# Altium schematic sheet USB-C_to_ESP.SchDoc
size B; SheetNumber: 2; SheetTotal: 6
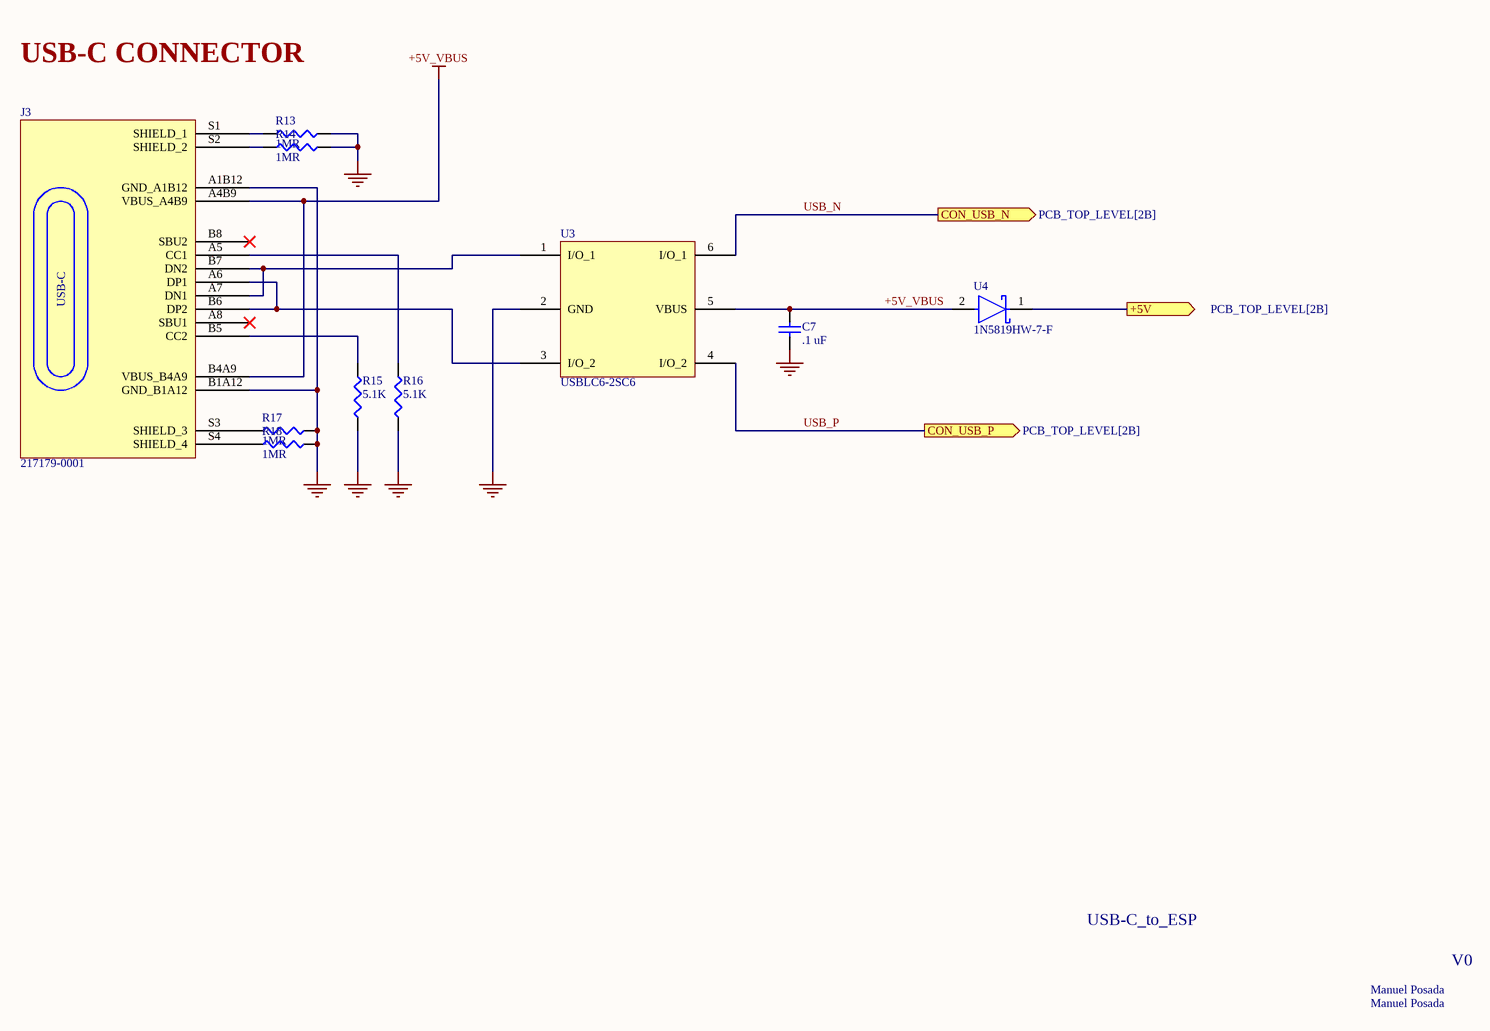
[diagram p0: USB-C_to_ESP.SchDoc]

## Parts
C7  .1 uF  [CAP_CL21_SAM-L]
J3  217179-0001  [FP-2171790001-MFG]
R13  1MR  [RES_1220_SUS-L]
R14  1MR  [RES_1220_SUS-L]
R15  5.1K  [RES_1220_SUS-L]
R16  5.1K  [RES_1220_SUS-L]
R17  1MR  [RES_1220_SUS-L]
R18  1MR  [RES_1220_SUS-L]
U3  USBLC6-2SC6  [SOT23-6L_STM]
U4  1N5819HW-7-F  [FP-SOD123-IPC_B]

## Ports
+5V (out, see PCB_TOP_LEVEL[2B]), CON_USB_N (out, see PCB_TOP_LEVEL[2B]), CON_USB_P (out, see PCB_TOP_LEVEL[2B])

## Nets
+5V_VBUS: C7.2 J3.A4B9(VBUS_A4B9) J3.B4A9(VBUS_B4A9) U3.5(VBUS) U4.2(A)
GND: C7.1 J3.A1B12(GND_A1B12) J3.B1A12(GND_B1A12) R13.2 R14.2 R15.1 R16.1 R17.2 R18.2 U3.2(GND)
+5V: U4.1(C) ; port +5V
USB_N: U3.6(I/O_1) ; port CON_USB_N
USB_P: U3.4(I/O_2) ; port CON_USB_P
NetJ3_A5: J3.A5(CC1) R16.2
NetJ3_A6: J3.A6(DP1) J3.B6(DP2) U3.3(I/O_2)
NetJ3_A7: J3.A7(DN1) J3.B7(DN2) U3.1(I/O_1)
NetJ3_B5: J3.B5(CC2) R15.2
NetJ3_S1: J3.S1(SHIELD_1) R13.1
NetJ3_S2: J3.S2(SHIELD_2) R14.1
NetJ3_S3: J3.S3(SHIELD_3) R17.1
NetJ3_S4: J3.S4(SHIELD_4) R18.1

Not connected (* = marked no-connect by the designer): J3 A8(SBU1)* B8(SBU2)*

## Notes on the sheet
- USB-C CONNECTOR
- USB-C_to_ESP
- Manuel Posada
- V0
- (in symbol 217179-0001) USB-C

## Library data of the parts
C7 = CL21B104KBCNNNC: 50V 100nF X7R ±10% 0805 Multilayer Ceramic Capacitors MLCC - SMD/SMT ROHS; Manufacturer: Samsung Electro-Mechanics; Supplier: DigiKey; Supplier Part Number: 1276-1003-6-ND; Manufacturer Part Number: CL21B104KBCNNNC; RoHS: Compliant; Category: Ceramic Capacitors; Stock: 2859375; Pricing: 1=0.08, 10=0.006 (USD); Value: 100nF; Case/Package: 0805; Case Code (Imperial): 0805; Case Code (Metric): 2012; China RoHS: Compliant; Contact Plating: Tin; Country of Origin: Mainland China, Philippines, South Korea; Depth: 1.25mm; Dielectric: X7R; Dielectric Material: Ceramic; Export Control Classification Number (ECCN) Code: EAR99; Height: 950µm; Harmonized Tariff Schedule (HTS) Code: 8532.24.00.20; Introduction Date: 2009-07-27; Lead Free: Lead Free; Length: 2mm; Lifecycle Status: Production; Material: Ceramic; Max Operating Temperature: 125°C; Min Operating Temperature: -55°C; Mounting Technology: Surface Mount; Number of Terminals: 2; Radiation Hardening: No; REACH SVHC: Yes; Schedule B: 8532240020, 8532240020|8532240020, 8532240020|8532240020|8532240020, 8532240020|8532240020|8532240020|8532240020; Thickness: 939.8µm; Tolerance: 10%; Voltage: 50V; Voltage Rating: 50V; Voltage Rating (DC): 50V; Width: 1.25mm; ComponentLink1URL: https://datasheet.octopart.com:443/CL21B104KBCNNNC-Samsung-Electro-Mechanics-datasheet-137745078.pdf?src-supplier=IHS; ComponentLink1Description: https://datasheet.octopart.com:443/CL21B104KBCNNNC-Samsung-Electro-Mechanics-datasheet-137745078.pdf?src-supplier=IHS; ComponentLink2URL: https://datasheet.octopart.com/CL21B104KBCNNNC-Samsung-Electro-Mechanics-datasheet-8324245.pdf; ComponentLink2Description: https://datasheet.octopart.com/CL21B104KBCNNNC-Samsung-Electro-Mechanics-datasheet-8324245.pdf; ComponentLink3URL: https://datasheet.octopart.com/CL21B104KBCNNNC-Samsung-Electro-Mechanics-datasheet-97040617.pdf; ComponentLink3Description: https://datasheet.octopart.com/CL21B104KBCNNNC-Samsung-Electro-Mechanics-datasheet-97040617.pdf; ComponentLink4URL: https://datasheet.octopart.com:443/CL21B104KBCNNNC-Samsung-Electro-Mechanics-datasheet-11548950.pdf?src-supplier=Future+Electronics; ComponentLink4Description: https://datasheet.octopart.com:443/CL21B104KBCNNNC-Samsung-Electro-Mechanics-datasheet-11548950.pdf?src-supplier=Future+Electronics; ComponentLink5URL: https://datasheet.octopart.com:443/CL21B104KBCNNNC-Samsung-Electro-Mechanics-datasheet-116891032.pdf?src-supplier=Future+Electronics; ComponentLink5Description: https://datasheet.octopart.com:443/CL21B104KBCNNNC-Samsung-Electro-Mechanics-datasheet-116891032.pdf?src-supplier=Future+Electronics; ComponentLink6URL: https://datasheet.octopart.com:443/CL21B104KBCNNNC-Samsung-Electro-Mechanics-datasheet-81462175.pdf?src-supplier=Future+Electronics; ComponentLink6Description: https://datasheet.octopart.com:443/CL21B104KBCNNNC-Samsung-Electro-Mechanics-datasheet-81462175.pdf?src-supplier=Future+Electronics; ComponentLink7URL: https://datasheet.octopart.com:443/CL21B104KBCNNNC-Samsung-datasheet-42485244.pdf?src-supplier=Future+Electronics; ComponentLink7Description: https://datasheet.octopart.com:443/CL21B104KBCNNNC-Samsung-datasheet-42485244.pdf?src-supplier=Future+Electronics; ComponentLink8URL: https://datasheet.octopart.com:443/CL21B104KBCNNNC-Samsung-Electro-Mechanics-datasheet-149045937.pdf?src-supplier=Future+Electronics; ComponentLink8Description: https://datasheet.octopart.com:443/CL21B104KBCNNNC-Samsung-Electro-Mechanics-datasheet-149045937.pdf?src-supplier=Future+Electronics; ComponentLink9URL: https://datasheet.octopart.com:443/CL21B104KBCNNNC-Samsung-datasheet-8326407.pdf?src-supplier=TME; ComponentLink9Description: https://datasheet.octopart.com:443/CL21B104KBCNNNC-Samsung-datasheet-8326407.pdf?src-supplier=TME
J3 = 217179-0001: CONN RCP USB2.0 TYP C 24P SMD RA; Manufacturer: Molex; Supplier: Digikey; Supplier Part Number: 900-2171790001CT-ND; Manufacturer Part Number: 217179-0001; RoHS: No; Category: Connectors; Stock: 7228; Pricing: 1=0.9, 10=0.745, 100=0.6212 (USD); LCSC Part Number: C3197684
R13 R14 R17 R18 = RG2012P-105-B-T5: Res Thin Film 0805 1M Ohm 0.1% 0.125W(1/8W) ±25ppm/C Sulfur Resistant Pad SMD Automotive T/R; Manufacturer: Susumu; Power Dissipation: 125mW; Value: 1MΩ; Temperature Coefficient: 25ppm/°C; Voltage Rating: 150V; Supplier: DigiKey; Supplier Part Number: 408-RG2012P-105-B-T5CT-ND; Manufacturer Part Number: RG2012P-105-B-T5; RoHS: Compliant; Category: Chip SMD Resistors; Stock: 192478; Pricing: 1=0.1, 10=0.077, 25=0.0712, 50=0.0672, 100=0.0635, 250=0.05896, 500=0.0558, 1000=0.0529 (USD); Case/Package: 0805; Case Code (Imperial): 0805; Case Code (Metric): 2012; Composition: Thin Film; Country of Origin: Mainland China, Japan; Export Control Classification Number (ECCN) Code: EAR99; Height: 400µm; Harmonized Tariff Schedule (HTS) Code: 8533.21.00.30; Introduction Date: 2006-03-30; Lead Free: Lead Free; Length: 2mm; Lifecycle Status: Production; Max Operating Temperature: 155°C; Min Operating Temperature: -55°C; Mounting Technology: Surface Mount; Number of Terminals: 2; Power Rating: 125mW; REACH SVHC: Yes; Termination: SMD/SMT; Tolerance: 0.1%; Voltage Rating (DC): 150V; Width: 1.25mm; Working Voltage: 150V; ComponentLink1URL: https://datasheet.octopart.com:443/RG2012P-105-B-T5-Susumu-datasheet-182148308.pdf?src-supplier=IHS; ComponentLink1Description: https://datasheet.octopart.com:443/RG2012P-105-B-T5-Susumu-datasheet-182148308.pdf?src-supplier=IHS; ComponentLink2URL: https://datasheet.octopart.com:443/RG2012P-105-B-T5-Susumu-datasheet-104167497.pdf?src-supplier=Upverter; ComponentLink2Description: https://datasheet.octopart.com:443/RG2012P-105-B-T5-Susumu-datasheet-104167497.pdf?src-supplier=Upverter; ComponentLink3URL: https://datasheet.octopart.com:443/RG2012P-105-B-T5-Susumu-datasheet-68296037.pdf?src-supplier=Future+Electronics; ComponentLink3Description: https://datasheet.octopart.com:443/RG2012P-105-B-T5-Susumu-datasheet-68296037.pdf?src-supplier=Future+Electronics; ComponentLink4URL: https://datasheet.octopart.com:443/RG2012P-105-B-T5-Susumu-datasheet-12510050.pdf?src-supplier=Future+Electronics; ComponentLink4Description: https://datasheet.octopart.com:443/RG2012P-105-B-T5-Susumu-datasheet-12510050.pdf?src-supplier=Future+Electronics; ComponentLink5URL: https://datasheet.octopart.com/RG2012P-105-B-T5-Susumu-datasheet-12509734.pdf; ComponentLink5Description: https://datasheet.octopart.com/RG2012P-105-B-T5-Susumu-datasheet-12509734.pdf
R15 R16 = RG2012P-512-B-T5: Res Thin Film 0805 5.1K Ohm 0.1% 0.125W(1/8W) ±25ppm/C Sulfur Resistant Pad SMD Automotive T/R; Manufacturer: Susumu; Max Power Dissipation: 125mW; Value: 5.1kΩ; Temperature Coefficient: 25ppm/°C; Voltage Rating: 150V; Supplier: DigiKey; Supplier Part Number: RG20P5.1KBDKR-ND; Manufacturer Part Number: RG2012P-512-B-T5; RoHS: Compliant; Category: Chip SMD Resistors; Stock: 18763; Pricing: 1=0.12, 10=0.1, 25=0.0928, 50=0.0876, 100=0.0828, 250=0.07684, 500=0.07274, 1000=0.06901 (USD); Case/Package: 0805; Case Code (Imperial): 0805; Case Code (Metric): 2012; Composition: Thin Film; Features: Automotive AEC-Q200; Height: 400µm; Lead Free: Lead Free; Length: 2.0066mm; Lifecycle Status: Production; Max Operating Temperature: 155°C; Min Operating Temperature: -55°C; Mounting Technology: Surface Mount; Number of Terminals: 2; Number of Terminations: 2; Power Dissipation: 125mW; Power Rating: 125mW; REACH SVHC: Yes; Schedule B: 8533210045, 8533210045|8533210045|8533210045|8533210045|8533210045; Termination: SMD/SMT; Tolerance: 0.1%; Voltage Rating (DC): 150V; Width: 1.25mm; Working Voltage: 150V; ComponentLink1URL: https://datasheet.octopart.com:443/RG2012P-512-B-T5-Susumu-datasheet-182148308.pdf?src-supplier=IHS; ComponentLink1Description: https://datasheet.octopart.com:443/RG2012P-512-B-T5-Susumu-datasheet-182148308.pdf?src-supplier=IHS; ComponentLink2URL: https://datasheet.octopart.com:443/RG2012P-512-B-T5-Susumu-datasheet-104167497.pdf?src-supplier=Upverter; ComponentLink2Description: https://datasheet.octopart.com:443/RG2012P-512-B-T5-Susumu-datasheet-104167497.pdf?src-supplier=Upverter; ComponentLink3URL: https://datasheet.octopart.com:443/RG2012P-512-B-T5-Susumu-datasheet-12510102.pdf?src-supplier=Future+Electronics; ComponentLink3Description: https://datasheet.octopart.com:443/RG2012P-512-B-T5-Susumu-datasheet-12510102.pdf?src-supplier=Future+Electronics; ComponentLink4URL: https://datasheet.octopart.com:443/RG2012P-512-B-T5-Susumu-datasheet-12510050.pdf?src-supplier=Future+Electronics; ComponentLink4Description: https://datasheet.octopart.com:443/RG2012P-512-B-T5-Susumu-datasheet-12510050.pdf?src-supplier=Future+Electronics; ComponentLink5URL: https://datasheet.octopart.com/RG2012P-512-B-T5-Susumu-datasheet-12509734.pdf; ComponentLink5Description: https://datasheet.octopart.com/RG2012P-512-B-T5-Susumu-datasheet-12509734.pdf; ComponentLink6URL: https://datasheet.octopart.com:443/RG2012P-512-B-T5-Susumu-datasheet-118552.pdf?src-supplier=DigiKey; ComponentLink6Description: https://datasheet.octopart.com:443/RG2012P-512-B-T5-Susumu-datasheet-118552.pdf?src-supplier=DigiKey
U3 = USBLC6-2SC6: 17V Clamp 5A (8/20µs) Ipp Tvs Diode Surface Mount SOT-23-6; Manufacturer: STMicroelectronics; Breakdown Voltage: 6V; Value: 2.5pF; Data Rate: 480Mbps; Direction: Unidirectional; Element Configuration: Dual; ESD Protection: Yes; Forward Voltage: 1.1V; Leakage Current: 150nA; Max Junction Temperature (Tj): 125°C; Max Repetitive Reverse Voltage (Vrrm): 5.25V; Number of Bidirectional Channels: 2; Number of Elements: 1; Reverse Standoff Voltage: 5V; Test Current: 1mA; Supplier: DigiKey; Supplier Part Number: 497-5235-1-ND; Manufacturer Part Number: USBLC6-2SC6; RoHS: Compliant; Category: TVS Diodes; Stock: 229189; Pricing: 1=0.36, 10=0.243, 100=0.163, 500=0.127, 1000=0.114, 3000=0.077, 6000=0.076, 9000=0.075 (USD); Case/Package: SOT-23; China RoHS: Compliant; Clamping Voltage: 17V; Contact Plating: Tin; Country of Origin: Mainland China; Depth: 1.75mm; Export Control Classification Number (ECCN) Code: EAR99; Height: 1.45mm; Harmonized Tariff Schedule (HTS) Code: 8541.10.00.50; Introduction Date: 2005-03-15; Lead Free: Lead Free; Length: 3.05mm; Lifecycle Status: Production; Max Breakdown Voltage: 6V; Max Operating Temperature: 125°C; Max Reverse Leakage Current: 150nA; Min Breakdown Voltage: 6V; Min Operating Temperature: -40°C; Mounting Technology: Surface Mount; Number of Channels: 2; Pins: 6; Number of Terminals: 6; Operating Supply Voltage: 1.1V; Peak Pulse Current: 5A; Peak Reverse Current: 150nA; Polarity: Unidirectional; Power Line Protection: Yes; Radiation Hardening: No; REACH SVHC: Yes; Reverse Breakdown Voltage: 6V; Schedule B: 8536300000, 8536300000|8536300000|8536300000|8536300000|8536300000|8536300000|8536300000|8536300000|8536300000|8536300000|8536300000|8536300000|8536300000|8536300000|8536300000|8536300000|8536300000|8536300000|8536300000|8536300000|8536300000|8536300000|8536300000|85; Termination: SMD/SMT; Width: 1.75mm; Working Voltage: 5V; ComponentLink1URL: https://datasheet.octopart.com:443/USBLC6-2SC6-STMicroelectronics-datasheet-10412581.pdf?src-supplier=Newark; ComponentLink1Description: https://datasheet.octopart.com:443/USBLC6-2SC6-STMicroelectronics-datasheet-10412581.pdf?src-supplier=Newark; ComponentLink2URL: https://datasheet.octopart.com:443/USBLC6-2SC6-STMicroelectronics-datasheet-181961833.pdf?src-supplier=Newark; ComponentLink2Description: https://datasheet.octopart.com:443/USBLC6-2SC6-STMicroelectronics-datasheet-181961833.pdf?src-supplier=Newark; ComponentLink3URL: https://datasheet.octopart.com:443/USBLC6-2SC6-STMicroelectronics-datasheet-525477.pdf?src-supplier=Factory+Futures; ComponentLink3Description: https://datasheet.octopart.com:443/USBLC6-2SC6-STMicroelectronics-datasheet-525477.pdf?src-supplier=Factory+Futures; ComponentLink4URL: https://datasheet.octopart.com:443/USBLC6-2SC6-STMicroelectronics-datasheet-82998616.pdf?src-supplier=Farnell; ComponentLink4Description: https://datasheet.octopart.com:443/USBLC6-2SC6-STMicroelectronics-datasheet-82998616.pdf?src-supplier=Farnell; ComponentLink5URL: https://datasheet.octopart.com:443/USBLC6-2SC6-STMicroelectronics-datasheet-46285.pdf?src-supplier=Farnell; ComponentLink5Description: https://datasheet.octopart.com:443/USBLC6-2SC6-STMicroelectronics-datasheet-46285.pdf?src-supplier=Farnell; ComponentLink6URL: https://datasheet.octopart.com:443/USBLC6-2SC6-STMicroelectronics-datasheet-14050643.pdf?src-supplier=iiiC; ComponentLink6Description: https://datasheet.octopart.com:443/USBLC6-2SC6-STMicroelectronics-datasheet-14050643.pdf?src-supplier=iiiC; ComponentLink7URL: https://datasheet.octopart.com:443/USBLC6-2SC6-STMicroelectronics-datasheet-10521292.pdf?src-supplier=Jameco; ComponentLink7Description: https://datasheet.octopart.com:443/USBLC6-2SC6-STMicroelectronics-datasheet-10521292.pdf?src-supplier=Jameco
U4 = 1N5819HW-7-F: DIODE SCHOTTKY 40V 1A SOD123; Manufacturer: Diodes Inc.; Value: 50pF; Element Configuration: Single; Forward Voltage: 750mV; Max Forward Surge Current (Ifsm): 25A; Max Junction Temperature (Tj): 125°C; Max Power Dissipation: 450mW; Number of Elements: 1; Peak Reverse Current: 1mA; Polarity: Standard; Supplier: DigiKey; Supplier Part Number: 1N5819HW-FDICT-ND; Manufacturer Part Number: 1N5819HW-7-F; RoHS: Compliant; Category: Schottky Diodes; Stock: 184558; Pricing: 1=0.29, 10=0.166, 100=0.1036, 500=0.07624, 1000=0.06736, 3000=0.0505, 6000=0.044, 9000=0.03923, 15000=0.039, 21000=0.03886, 30000=0.03872, 75000=0.03561, 150000=0.0323 (USD); Average Rectified Current: 1A; Case/Package: SOD-123-2; China RoHS: Compliant; Contact Plating: Tin; Current Rating: 1A; Forward Current: 1A; Height: 1.45mm; Lead Free: Lead Free; Length: 2.85mm; Lifecycle Status: Production; Max Operating Temperature: 125°C; Max Output current: 1A; Max Repetitive Reverse Voltage (Vrrm): 40V; Max Reverse Voltage (DC): 40V; Min Breakdown Voltage: 40V; Min Operating Temperature: -65°C; Pins: 2; Number of Terminals: 2; Output Current: 1A; Packaging: Tape and Reel; Peak Non-Repetitive Surge Current: 25A; Radiation Hardening: No; REACH SVHC: Yes; Reverse Standoff Voltage: 40V; Reverse Voltage: 40V; Schedule B: 8541100080, 8541100080|8541100080|8541100080|8541100080|8541100080; Termination: SMD/SMT; Voltage Rating (DC): 40V; Weight: 10.007382mg; Width: 1.7mm; ComponentLink1URL: https://datasheet.octopart.com:443/1N5819HW-7-F-Diodes-Inc.-datasheet-180549196.pdf?src-supplier=IHS; ComponentLink1Description: https://datasheet.octopart.com:443/1N5819HW-7-F-Diodes-Inc.-datasheet-180549196.pdf?src-supplier=IHS; ComponentLink2URL: https://datasheet.octopart.com:443/1N5819HW-7-F-Diodes-Inc.-datasheet-8332965.pdf?src-supplier=Upverter; ComponentLink2Description: https://datasheet.octopart.com:443/1N5819HW-7-F-Diodes-Inc.-datasheet-8332965.pdf?src-supplier=Upverter; ComponentLink3URL: https://sigma.octopart.com:443/138895985/technical_drawing/Diodes-Inc.-1N5819HW-7-F.pdf?src-supplier=Upverter; ComponentLink3Description: https://sigma.octopart.com:443/138895985/technical_drawing/Diodes-Inc.-1N5819HW-7-F.pdf?src-supplier=Upverter; ComponentLink4URL: https://datasheet.octopart.com:443/1N5819HW-7-F-Diodes-Inc.-datasheet-134530231.pdf?src-supplier=Future+Electronics; ComponentLink4Description: https://datasheet.octopart.com:443/1N5819HW-7-F-Diodes-Inc.-datasheet-134530231.pdf?src-supplier=Future+Electronics; ComponentLink5URL: https://datasheet.octopart.com:443/1N5819HW-7-F-Diodes-Inc.-datasheet-34441420.pdf?src-supplier=Future+Electronics; ComponentLink5Description: https://datasheet.octopart.com:443/1N5819HW-7-F-Diodes-Inc.-datasheet-34441420.pdf?src-supplier=Future+Electronics; ComponentLink6URL: https://datasheet.octopart.com:443/1N5819HW-7-F-Diodes-Inc.-datasheet-10497210.pdf?src-supplier=Future+Electronics; ComponentLink6Description: https://datasheet.octopart.com:443/1N5819HW-7-F-Diodes-Inc.-datasheet-10497210.pdf?src-supplier=Future+Electronics; ComponentLink7URL: https://datasheet.octopart.com:443/1N5819HW-7-F-Diodes-Inc.-datasheet-169364014.pdf?src-supplier=Newark; ComponentLink7Description: https://datasheet.octopart.com:443/1N5819HW-7-F-Diodes-Inc.-datasheet-169364014.pdf?src-supplier=Newark; ComponentLink8URL: https://datasheet.octopart.com:443/1N5819HW-7-F-Diodes-Inc.-datasheet-78715396.pdf?src-supplier=Newark; ComponentLink8Description: https://datasheet.octopart.com:443/1N5819HW-7-F-Diodes-Inc.-datasheet-78715396.pdf?src-supplier=Newark; ComponentLink9URL: https://datasheet.octopart.com:443/1N5819HW-7-F-Diodes-Inc.-datasheet-14053419.pdf?src-supplier=iiiC; ComponentLink9Description: https://datasheet.octopart.com:443/1N5819HW-7-F-Diodes-Inc.-datasheet-14053419.pdf?src-supplier=iiiC; ComponentLink10URL: https://datasheet.octopart.com:443/1N5819HW-7-F-Diodes-Inc.-datasheet-7274306.pdf?src-supplier=Jameco; ComponentLink10Description: https://datasheet.octopart.com:443/1N5819HW-7-F-Diodes-Inc.-datasheet-7274306.pdf?src-supplier=Jameco; ComponentLink11URL: https://datasheet.octopart.com:443/1N5819HW-7-F-Diodes-Inc.-datasheet-16627.pdf?src-supplier=Mouser; ComponentLink11Description: https://datasheet.octopart.com:443/1N5819HW-7-F-Diodes-Inc.-datasheet-16627.pdf?src-supplier=Mouser; ComponentLink12URL: https://datasheet.octopart.com:443/1N5819HW-7-F-Diodes-Inc.-datasheet-145195.pdf?src-supplier=DigiKey; ComponentLink12Description: https://datasheet.octopart.com:443/1N5819HW-7-F-Diodes-Inc.-datasheet-145195.pdf?src-supplier=DigiKey; ComponentLink13URL: http://sigma.octopart.com:80/15616867/materials_sheet/Diodes-Inc.-1N5819HW-7-F.pdf?src-supplier=Compliance+Statements; ComponentLink13Description: http://sigma.octopart.com:80/15616867/materials_sheet/Diodes-Inc.-1N5819HW-7-F.pdf?src-supplier=Compliance+Statements